# Altium project ayplayer2.22.PrjPCB
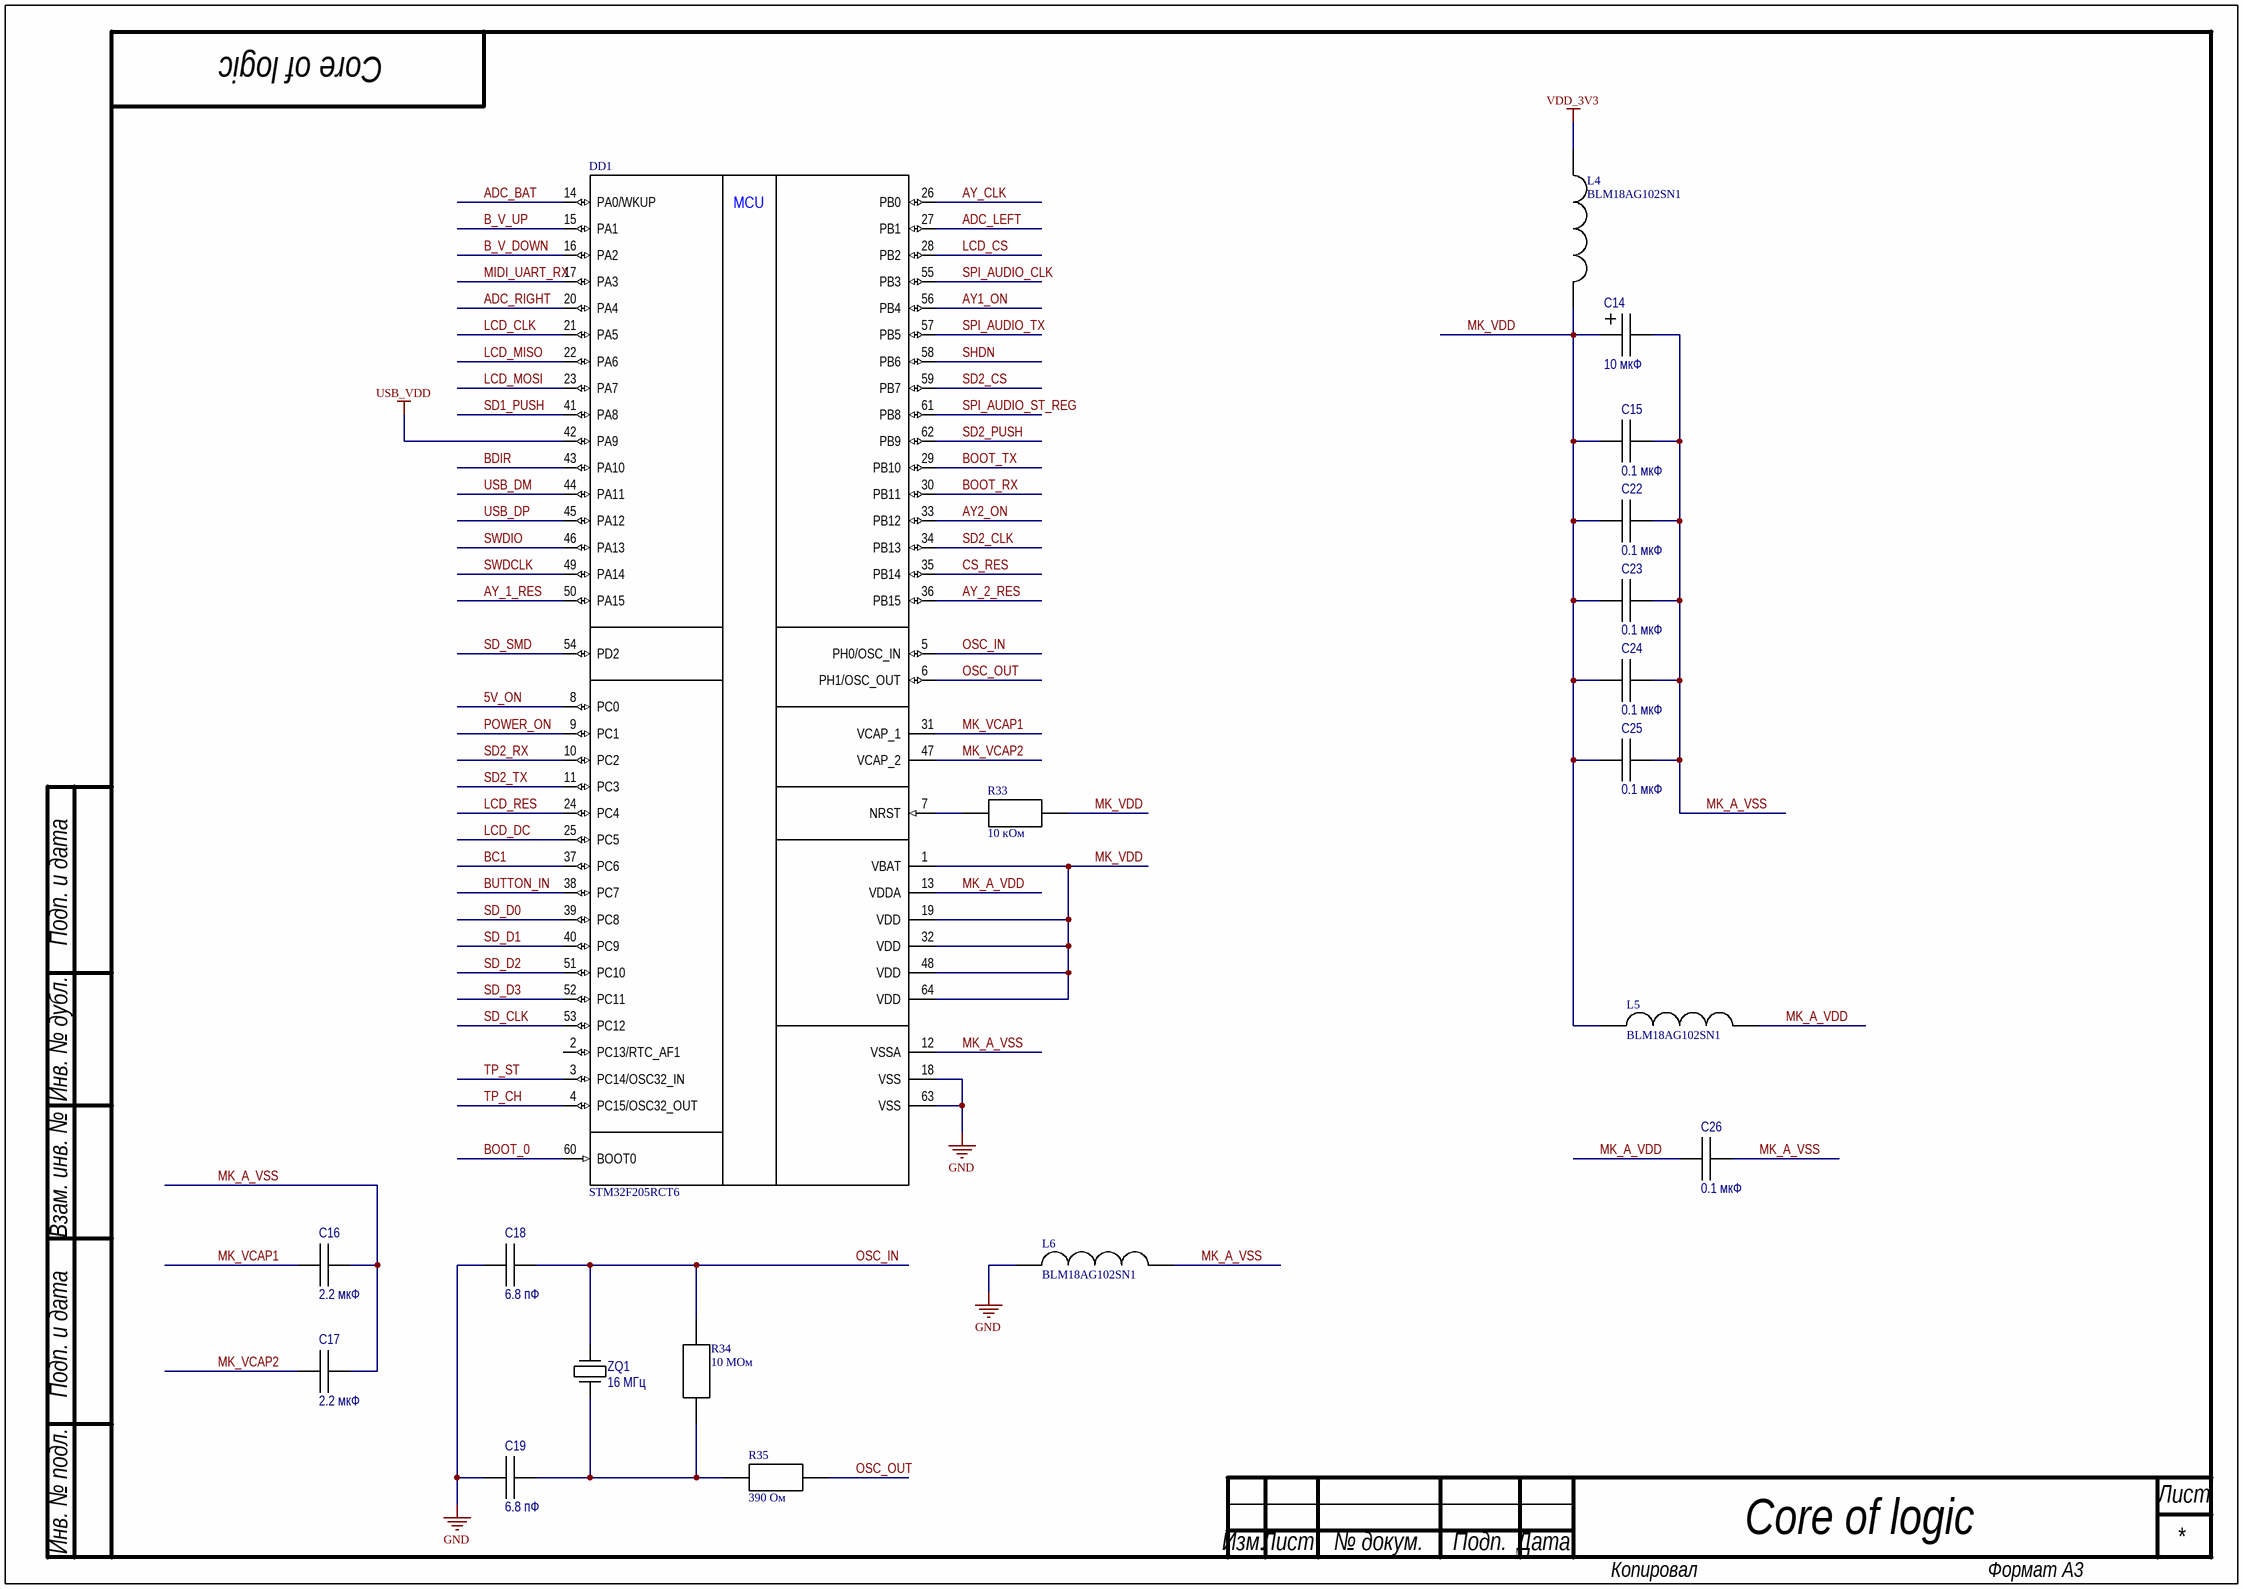
[diagram p0: mk.SchDoc]
5 sheets, 161 parts. Net scope: global (net labels, ports and power ports of the same name join across sheets).
Board file: main.PcbDoc
Sheets:
  mk.SchDoc
  power_sheet.SchDoc
  conect_sheet.SchDoc
  audio_sheet.SchDoc
  audio_out.SchDoc

## Sheet mk.SchDoc
size 420 x 297 mm; DocumentNumber: Core of logic

### Parts
C14  10 мкФ  [C TAN_C]
C15  0.1 мкФ  [C 1206]
C16  2.2 мкФ  [C 1206]
C17  2.2 мкФ  [C 1206]
C18  6.8 пФ  [C 1206]
C19  6.8 пФ  [C 1206]
C22  0.1 мкФ  [C 1206]
C23  0.1 мкФ  [C 1206]
C24  0.1 мкФ  [C 1206]
C25  0.1 мкФ  [C 1206]
C26  0.1 мкФ  [C 1206]
DD1  STM32F205RCT6  [LQFP64]
L4  BLM18AG102SN1  [FB 0603]
L5  BLM18AG102SN1  [FB 0603]
L6  BLM18AG102SN1  [FB 0603]
R33  10 кОм  [RES 0805]
R34  10 МОм  [RES 0805]
R35  390 Ом  [RES 0805]
ZQ1  value 16 МГц  [NX3225SA]  (hidden comment: NX3225SA-16.000M-STD-CRS-2)

### Nets
GND: C18.1 C19.1 DD1.18(VSS) DD1.63(VSS) L6.1
USB_VDD: DD1.42(PA9)
VDD_3V3: L4.1
5V_ON: DD1.8(PC0)
ADC_BAT: DD1.14(PA0/WKUP)
ADC_LEFT: DD1.27(PB1)
ADC_RIGHT: DD1.20(PA4)
AY1_ON: DD1.56(PB4)
AY2_ON: DD1.33(PB12)
AY_1_RES: DD1.50(PA15)
AY_2_RES: DD1.36(PB15)
AY_CLK: DD1.26(PB0)
B_V_DOWN: DD1.16(PA2)
B_V_UP: DD1.15(PA1)
BC1: DD1.37(PC6)
BDIR: DD1.43(PA10)
BOOT_0: DD1.60(BOOT0)
BOOT_RX: DD1.30(PB11)
BOOT_TX: DD1.29(PB10)
BUTTON_IN: DD1.38(PC7)
CS_RES: DD1.35(PB14)
LCD_CLK: DD1.21(PA5)
LCD_CS: DD1.28(PB2)
LCD_DC: DD1.25(PC5)
LCD_MISO: DD1.22(PA6)
LCD_MOSI: DD1.23(PA7)
LCD_RES: DD1.24(PC4)
MIDI_UART_RX: DD1.17(PA3)
MK_A_VDD: C26.1 DD1.13(VDDA) L5.2
MK_A_VSS: C14.2 C15.2 C16.2 C17.2 C22.2 C23.2 C24.2 C25.2 C26.2 DD1.12(VSSA) L6.2
MK_VCAP1: C16.1 DD1.31(VCAP_1)
MK_VCAP2: C17.1 DD1.47(VCAP_2)
MK_VDD: C14.1 C15.1 C22.1 C23.1 C24.1 C25.1 DD1.1(VBAT) DD1.19(VDD) DD1.32(VDD) DD1.48(VDD) DD1.64(VDD) L4.2 L5.1 R33.2
OSC_IN: C18.2 DD1.5(PH0/OSC_IN) R34.2 ZQ1.3(XO)
OSC_OUT: DD1.6(PH1/OSC_OUT) R35.2
POWER_ON: DD1.9(PC1)
SD1_PUSH: DD1.41(PA8)
SD2_CLK: DD1.34(PB13)
SD2_CS: DD1.59(PB7)
SD2_PUSH: DD1.62(PB9)
SD2_RX: DD1.10(PC2)
SD2_TX: DD1.11(PC3)
SD_CLK: DD1.53(PC12)
SD_D0: DD1.39(PC8)
SD_D1: DD1.40(PC9)
SD_D2: DD1.51(PC10)
SD_D3: DD1.52(PC11)
SD_SMD: DD1.54(PD2)
SHDN: DD1.58(PB6)
SPI_AUDIO_CLK: DD1.55(PB3)
SPI_AUDIO_ST_REG: DD1.61(PB8)
SPI_AUDIO_TX: DD1.57(PB5)
SWDCLK: DD1.49(PA14)
SWDIO: DD1.46(PA13)
TP_CH: DD1.4(PC15/OSC32_OUT)
TP_ST: DD1.3(PC14/OSC32_IN)
USB_DM: DD1.44(PA11)
USB_DP: DD1.45(PA12)
NetC19_2: C19.2 R34.1 R35.1 ZQ1.1(XI)
NetDD1_7: DD1.7(NRST) R33.1

Not connected (* = marked no-connect by the designer): DD1 2(PC13/RTC_AF1); ZQ1 2(NC) 4(NC)

### Notes on the sheet
- Подп. и дата
- Инв. № дубл.
- Взам. инв. №
- Инв. № подл.
- Лист
- Изм.
- № докум.
- Подп.
- Дата
- Копировал
- Формат А3
- (in symbol STM32F205RCT6) MCU

### Library data of the parts
C14 = CAP TAN_C: SMD Tantalium Capacitor C; Manufacturer: /Укажите компанию-производителя/; Tolerance: /Укажите допуск в процентах/; Type: Конденсатор танталовый; ESR: /Укажите значение ЭПС/; Size: C; Temperature range: /Формат: -? ... ? °C/; Value: 10 мкФ
C15-C19 C22-C26 = CAP 1206: SMD Capacitor 1206; Manufacturer: /Укажите компанию-производителя/; Tolerance: /Укажите допуск в процентах/; Temperature coefficient: /Формат: ±? ppm/°C/; Type: Конденсатор керамический; TC: /Укажите тип диэлектрика/; Size: 1206; Temperature range: /Формат: -? ... ? °C/
  C15 C22-C26: Value: 0.1 мкФ
  C16 C17: Value: 2.2 мкФ
  C18 C19: Value: 6.8 пФ
R33-R35 = RES 0805
ZQ1 = NX3225SA-16.000M-STD-CRS-2: QUARTZ CRYSTAL; Manufacturer: NDK; Load capacitance: 8 пФ; Frequency stability: ±15 ppm; Type: Кварцевый резонатор; Temperature range: -40 ... 125 °C

## Sheet power_sheet.SchDoc
size 420 x 297 mm; DocumentNumber: Power supply
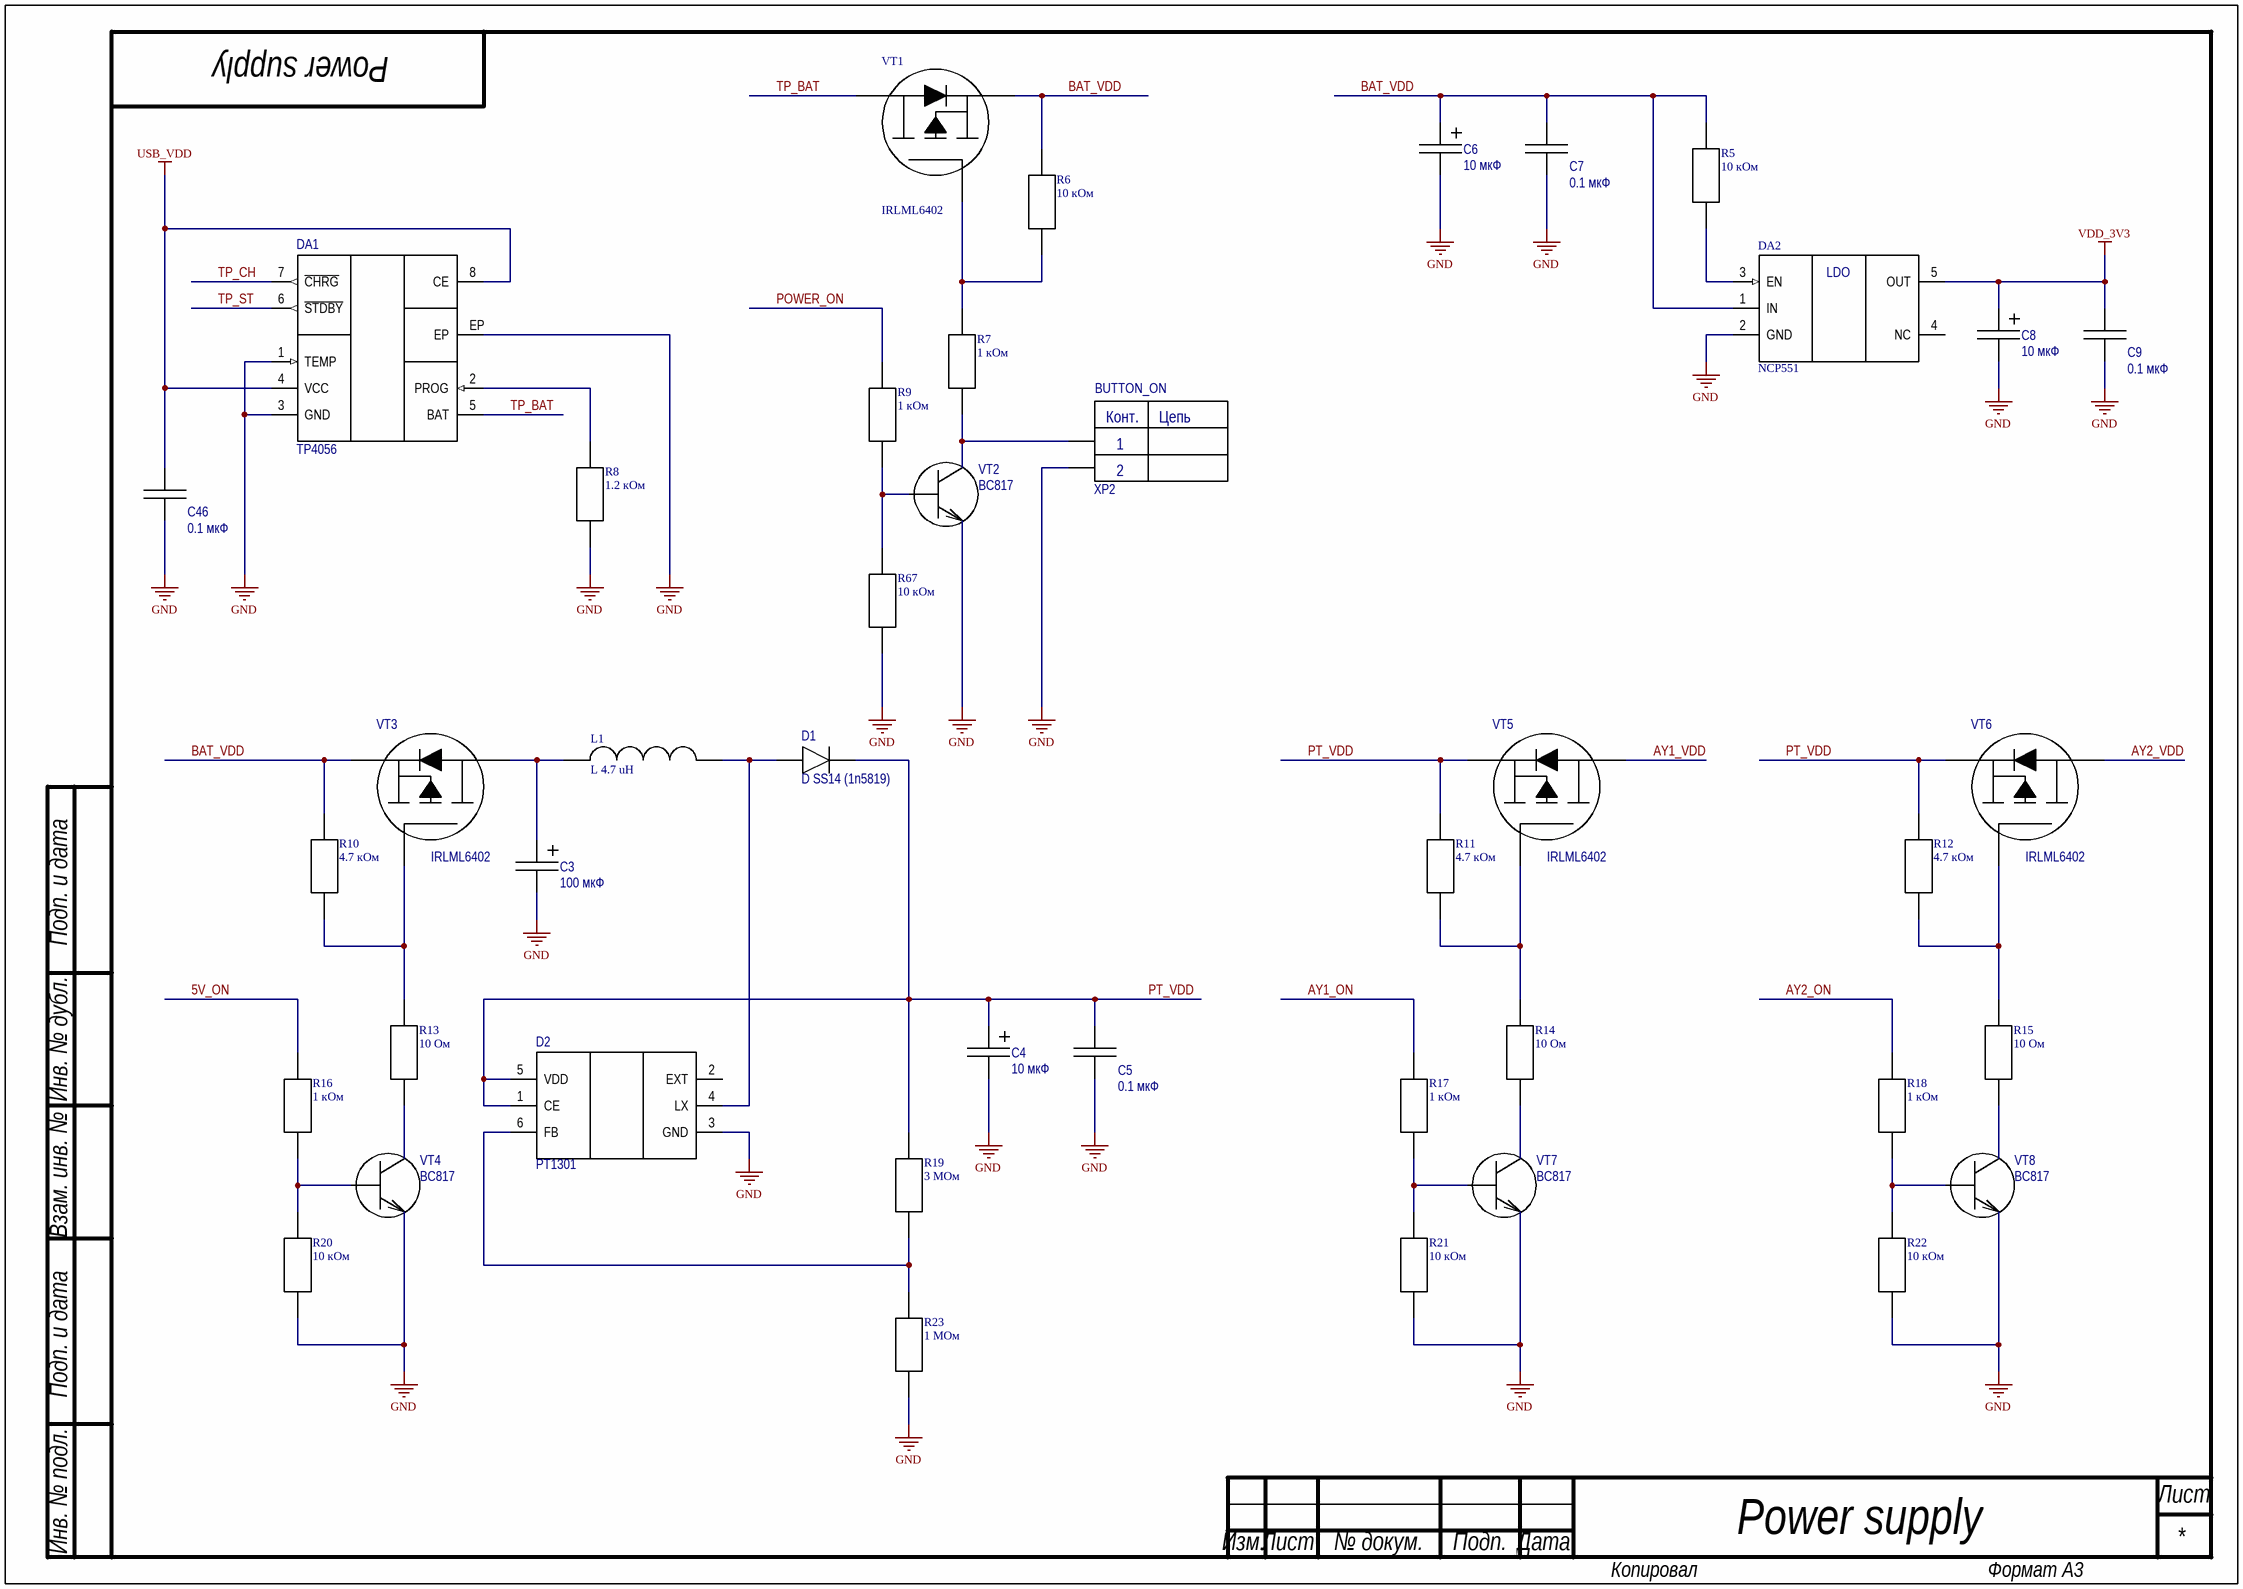
[diagram p1: power_sheet.SchDoc]

### Parts
C3  100 мкФ  [C TAN_D]
C4  10 мкФ  [C TAN_C]
C5  0.1 мкФ  [C 1206]
C6  10 мкФ  [C TAN_C]
C7  0.1 мкФ  [C 1206]
C8  10 мкФ  [C TAN_C]
C9  0.1 мкФ  [C 1206]
C46  0.1 мкФ  [C 1206]
D1  D SS14 (1n5819)  [SMA/DO-214AC]
D2  PT1301  [SOT-23-6]
DA1  TP4056  [HSOP-8]
DA2  NCP551  [TSOP-5]
L1  L 4.7 uH  [CD43]
R5  10 кОм  [RES 0805]
R6  10 кОм  [RES 0805]
R7  1 кОм  [RES 0805]
R8  1.2 кОм  [RES 0805]
R9  1 кОм  [RES 0805]
R10  4.7 кОм  [RES 0805]
R11  4.7 кОм  [RES 0805]
R12  4.7 кОм  [RES 0805]
R13  10 Ом  [RES 0805]
R14  10 Ом  [RES 0805]
R15  10 Ом  [RES 0805]
R16  1 кОм  [RES 0805]
R17  1 кОм  [RES 0805]
R18  1 кОм  [RES 0805]
R19  3 МОм  [RES 0805]
R20  10 кОм  [RES 0805]
R21  10 кОм  [RES 0805]
R22  10 кОм  [RES 0805]
R23  1 МОм  [RES 0805]
R67  10 кОм  [RES 0805]
VT1  IRLML6402  [SOT-23]
VT2  BC817  [SOT-23]
VT3  IRLML6402  [SOT-23]
VT4  BC817  [SOT-23]
VT5  IRLML6402  [SOT-23]
VT6  IRLML6402  [SOT-23]
VT7  BC817  [SOT-23]
VT8  BC817  [SOT-23]
XP2  PLS-2  [PLS-2]  (value not drawn)

### Nets
GND: C3.2 C4.2 C5.2 C6.2 C7.2 C8.2 C9.2 C46.2 D2.3(GND) DA1.1(TEMP) DA1.3(GND) DA1.EP DA2.2(GND) R8.1 R20.1 R21.1 R22.1 R23.1 R67.1 VT2.2(E) VT4.2(E) VT7.2(E) VT8.2(E) XP2.2
USB_VDD: C46.1 DA1.4(VCC) DA1.8(CE)
VDD_3V3: C8.1 C9.1 DA2.5(OUT)
5V_ON: R16.2
AY1_ON: R17.2
AY1_VDD: VT5.3(D)
AY2_ON: R18.2
AY2_VDD: VT6.3(D)
BAT_VDD: C6.1 C7.1 DA2.1(IN) R5.2 R6.2 R10.2 VT1.2(S) VT3.2(S)
POWER_ON: R9.2
PT_VDD: C4.1 C5.1 D1.C D2.1(CE) D2.5(VDD) R11.2 R12.2 R19.2 VT5.2(S) VT6.2(S)
TP_BAT: DA1.5(BAT) VT1.3(D)
TP_CH: DA1.7(~{CHRG})
TP_ST: DA1.6(~{STDBY})
NetC3_1: C3.1 L1.1 VT3.3(D)
NetD1_A: D1.A D2.4(LX) L1.2
NetD2_6: D2.6(FB) R19.1 R23.2
NetDA1_2: DA1.2(PROG) R8.2
NetDA2_3: DA2.3(EN) R5.1
NetR6_1: R6.1 R7.2 VT1.1(G)
NetR7_1: R7.1 VT2.3(C) XP2.1
NetR9_1: R9.1 R67.2 VT2.1(B)
NetR10_1: R10.1 R13.2 VT3.1(G)
NetR11_1: R11.1 R14.2 VT5.1(G)
NetR12_1: R12.1 R15.2 VT6.1(G)
NetR13_1: R13.1 VT4.3(C)
NetR14_1: R14.1 VT7.3(C)
NetR15_1: R15.1 VT8.3(C)
NetR16_1: R16.1 R20.2 VT4.1(B)
NetR17_1: R17.1 R21.2 VT7.1(B)
NetR18_1: R18.1 R22.2 VT8.1(B)

Not connected (* = marked no-connect by the designer): D2 2(EXT); DA2 4(NC)

### Notes on the sheet
- (near XP2) BUTTON_ON
- Подп. и дата
- Инв. № дубл.
- Взам. инв. №
- Инв. № подл.
- Лист
- Изм.
- № докум.
- Подп.
- Дата
- Копировал
- Формат А3
- (in symbol NCP551) LDO
- (in symbol PLS-2) Конт.; Цепь

### Library data of the parts
C3 = CAP TAN_D: SMD Tantalium Capacitor D; Manufacturer: /Укажите компанию-производителя/; Tolerance: /Укажите допуск в процентах/; Type: Конденсатор танталовый; ESR: /Укажите значение ЭПС/; Rated voltage: 10 В; Size: D; Temperature range: /Формат: -? ... ? °C/; Value: 100 мкФ
C4 C6 C8 = CAP TAN_C: as C14 on sheet mk; Size: C; Temperature range: /Формат: -? ... ? °C/; Value: 10 мкФ
C5 C7 C9 C46 = CAP 1206: as C15 on sheet mk; Size: 1206; Temperature range: /Формат: -? ... ? °C/; Value: 0.1 мкФ
D2 = PT1301: DC-DC step-up (повышающий) PT1301 в корпусе SOT23-6.
L1 = L 4.7 uH: Катушка индуктивности 4.7 мкГн корпус CD43 (индуктивность 4.7 uH).
R5-R23 R67 = RES 0805
VT2 VT4 VT7 VT8 = BC817: NPN general-purpose transistor; Manufacturer: NXP; Structure: n-p-n; Type: Транзистор биполярный; hFE: 160 ... 600; Max collector-emitter voltage: 45 В; Max collector-base voltage: 50 В; Max emitter-base voltage: 5 В; Max collector current: 0,5 А; Max collector peak current: 1 А; Power dissitipation: 0,25 Вт; fT: 100 МГц; Collector-emitter saturation voltage: 0,7 В; Base-emitter on voltage: 1,2 В; Specitication: ЭКБ ИП; Collector-base сapacitance: 3 пФ; Complement: BC807; Temperature range: -65 ... 150 °C
XP2 = PLS-2: PLS connector; Manufacturer: NONAME; Connector type: Вилка на плату; Number of contacts: 2; Type: Разъем штыревой

## Sheet conect_sheet.SchDoc
size 420 x 297 mm; DocumentNumber: Connectors
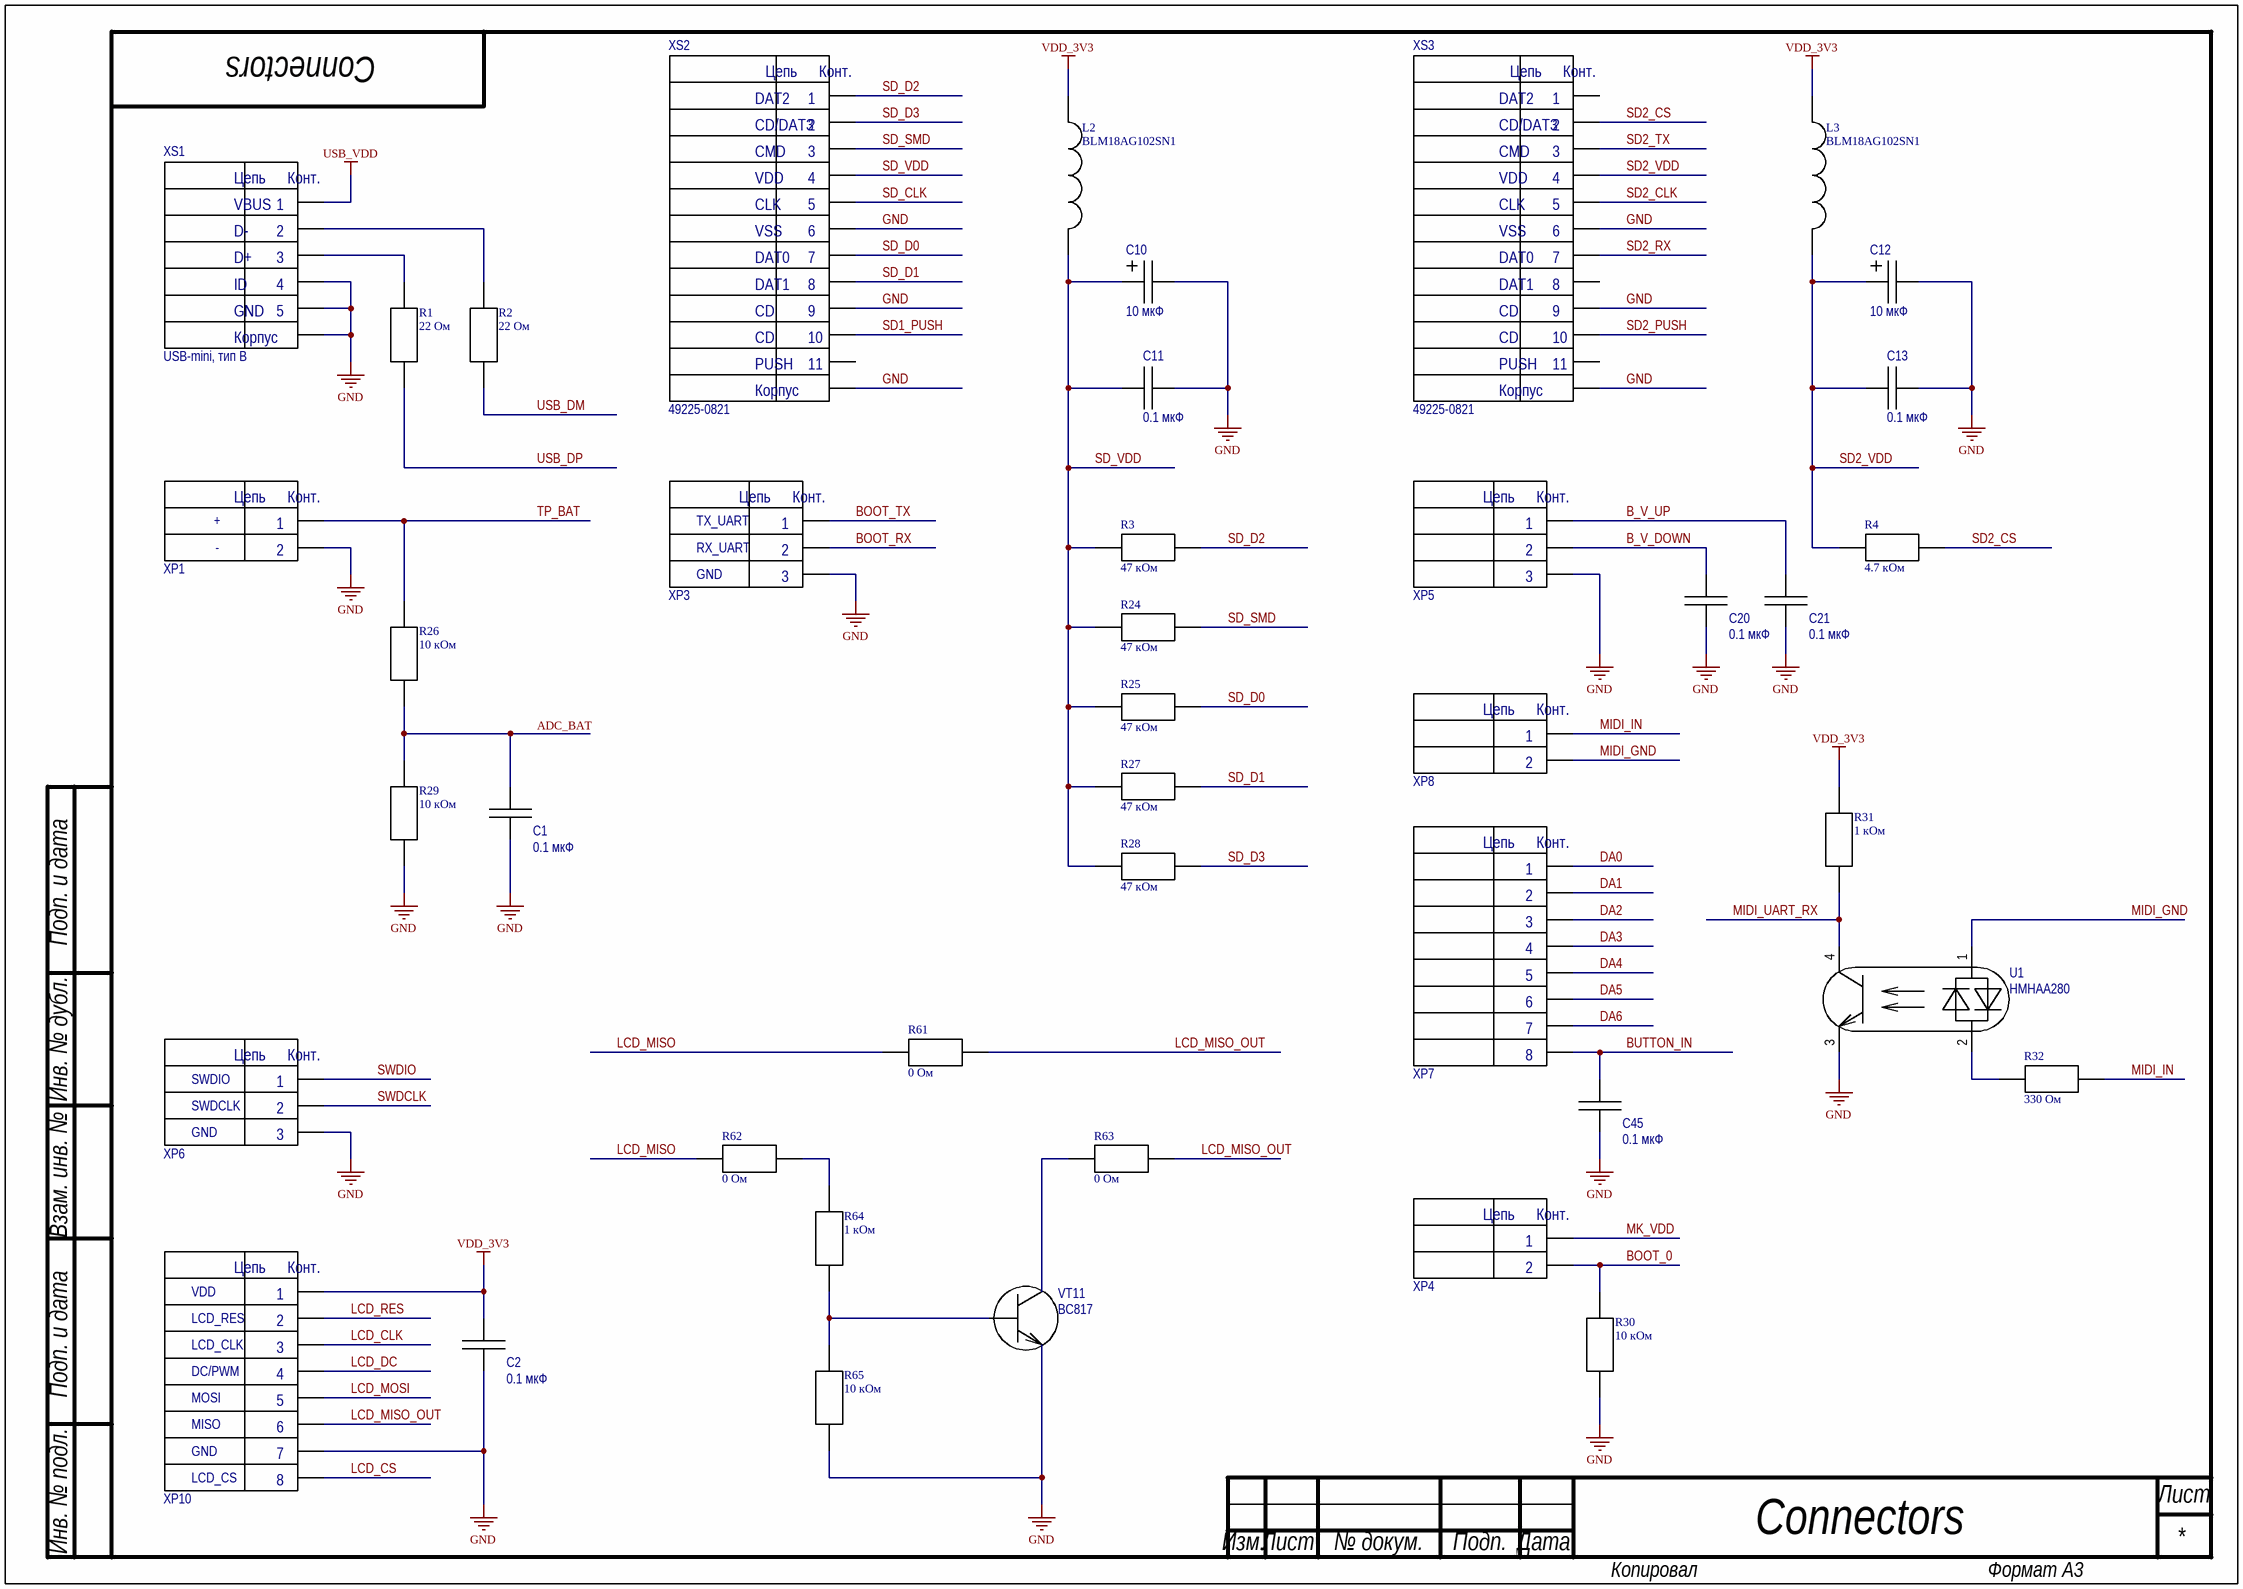
[diagram p2: conect_sheet.SchDoc]

### Parts
C1  0.1 мкФ  [C 1206]
C2  0.1 мкФ  [C 1206]
C10  10 мкФ  [C TAN_C]
C11  0.1 мкФ  [C 1206]
C12  10 мкФ  [C TAN_C]
C13  0.1 мкФ  [C 1206]
C20  0.1 мкФ  [C 1206]
C21  0.1 мкФ  [C 1206]
C45  0.1 мкФ  [C 1206]
L2  BLM18AG102SN1  [FB 0603]
L3  BLM18AG102SN1  [FB 0603]
R1  22 Ом  [RES 0805]
R2  22 Ом  [RES 0805]
R3  47 кОм  [RES 0805]
R4  4.7 кОм  [RES 0805]
R24  47 кОм  [RES 0805]
R25  47 кОм  [RES 0805]
R26  10 кОм  [RES 0805]
R27  47 кОм  [RES 0805]
R28  47 кОм  [RES 0805]
R29  10 кОм  [RES 0805]
R30  10 кОм  [RES 0805]
R31  1 кОм  [RES 0805]
R32  330 Ом  [RES 0805]
R61  0 Ом  [RES 0805]
R62  0 Ом  [RES 0805]
R63  0 Ом  [RES 0805]
R64  1 кОм  [RES 0805]
R65  10 кОм  [RES 0805]
U1  HMHAA280  [MFP-4L]
VT11  BC817  [SOT-23]
XP1  PLS-2  [PLS-2]  (value not drawn)
XP3  PLS-3  [PLS-3]  (value not drawn)
XP4  PLS-2  [PLS-2]  (value not drawn)
XP5  PLS-3  [PLS-3]  (value not drawn)
XP6  PLS-3  [PLS-3]  (value not drawn)
XP7  PLD-8  [PLD-8]  (value not drawn)
XP8  PLS-2  [PLS-2]  (value not drawn)
XP10  PLD-8  [PLD-8]  (value not drawn)
XS1  USB-mini, тип B  [USB_mini_B]
XS2  49225-0821  [MOLEX 49225-0821]
XS3  49225-0821  [MOLEX 49225-0821]

### Nets
GND: C1.2 C2.2 C10.2 C11.2 C12.2 C13.2 C20.2 C21.2 C45.2 R29.1 R30.1 R65.1 U1.3(E) VT11.2(E) XP1.2 XP3.3 XP5.3 XP6.3 XP10.7 XS1.0 XS1.4(CASE) XS1.5(GND) XS2.0 XS2.6 XS2.9 XS3.0 XS3.6 XS3.9
USB_VDD: XS1.1(VBUS)
VDD_3V3: C2.1 L2.1 L3.1 R31.2 XP10.1
ADC_BAT: C1.1 R26.1 R29.2
B_V_DOWN: C20.1 XP5.2
B_V_UP: C21.1 XP5.1
BOOT_0: R30.2 XP4.2
BOOT_RX: XP3.2
BOOT_TX: XP3.1
BUTTON_IN: C45.1 XP7.8
DA0: XP7.1
DA1: XP7.2
DA2: XP7.3
DA3: XP7.4
DA4: XP7.5
DA5: XP7.6
DA6: XP7.7
LCD_CLK: XP10.3
LCD_CS: XP10.8
LCD_DC: XP10.4
LCD_MISO: R61.1 R62.2
LCD_MISO_OUT: R61.2 R63.1 XP10.6
LCD_MOSI: XP10.5
LCD_RES: XP10.2
MIDI_GND: U1.1(AC) XP8.2
MIDI_IN: R32.2 XP8.1
MIDI_UART_RX: R31.1 U1.4(C)
MK_VDD: XP4.1
SD1_PUSH: XS2.10
SD2_CLK: XS3.5
SD2_CS: R4.2 XS3.2
SD2_PUSH: XS3.10
SD2_RX: XS3.7
SD2_TX: XS3.3
SD2_VDD: C12.1 C13.1 L3.2 R4.1 XS3.4
SD_CLK: XS2.5
SD_D0: R25.2 XS2.7
SD_D1: R27.2 XS2.8
SD_D2: R3.2 XS2.1
SD_D3: R28.2 XS2.2
SD_SMD: R24.2 XS2.3
SD_VDD: C10.1 C11.1 L2.2 R3.1 R24.1 R25.1 R27.1 R28.1 XS2.4
SWDCLK: XP6.2
SWDIO: XP6.1
TP_BAT: R26.2 XP1.1
USB_DM: R2.1
USB_DP: R1.1
NetR1_2: R1.2 XS1.3(D+)
NetR2_2: R2.2 XS1.2(D-)
NetR32_1: R32.1 U1.2(CA)
NetR62_1: R62.1 R64.2
NetR63_2: R63.2 VT11.3(C)
NetR64_1: R64.1 R65.2 VT11.1(B)

Not connected (* = marked no-connect by the designer): XS2 11; XS3 1 8 11

### Notes on the sheet
- +
- TX_UART
- -
- RX_UART
- GND
- SWDIO
- SWDCLK
- VDD
- LCD_RES
- LCD_CLK
- MOSI
- DC/PWM
- LCD_CS
- MISO
- Подп. и дата
- Инв. № дубл.
- Взам. инв. №
- Инв. № подл.
- Лист
- Изм.
- № докум.
- Подп.
- Дата
- Копировал
- Формат А3
- (in symbol 49225-0821) Цепь; Конт.; DAT2; CD/DAT3; CMD; VDD; CLK; VSS; DAT0; DAT1; CD; PUSH; Корпус
- (in symbol PLD-8) Цепь; Конт.
- (in symbol PLS-2) Цепь; Конт.
- (in symbol PLS-3) Цепь; Конт.
- (in symbol USB-mini_B) Цепь; Конт.; ID; Корпус

### Library data of the parts
C1 C2 C11 C13 C20 C21 C45 = CAP 1206: as C15 on sheet mk; Size: 1206; Temperature range: /Формат: -? ... ? °C/; Value: 0.1 мкФ
C10 C12 = CAP TAN_C: as C14 on sheet mk; Size: C; Temperature range: /Формат: -? ... ? °C/; Value: 10 мкФ
R1-R4 R24-R32 R61-R65 = RES 0805
U1 = HMHAA280: AC Input Half Pitch Mini-Flat Package 4-pin Optocoupler; Manufacturer: Fairchild Semiconductor; Emitter forward voltage: 1,4 В; Emitter power dissitipation: 60 мВт; Isolation voltage: 3750 В; Detector collector current: 50 мА; Emitter reverse voltage: 6 В; Detector collector-emitter voltage: 80 В; Detector power dissitipation: 150 мВт; Temperature range: -55 ... 100 °C; Type: Оптрон; Emitter forward current: 50 мА
VT11 = BC817: as VT2 on sheet power_sheet; Temperature range: -65 ... 150 °C
XP1 XP4 XP8 = PLS-2: as XP2 on sheet power_sheet; Type: Разъем штыревой
XP3 XP5 XP6 = PLS-3: PLS connector; Manufacturer: NONAME; Connector type: Вилка на плату; Number of contacts: 3; Type: Разъем штыревой
XP7 XP10 = PLD-8: PLD connector; Manufacturer: NONAME; Connector type: Вилка на плату; Number of contacts: 8; Type: Разъем штыревой
XS1 = USB-mini_B: USB-mini-B connector; Manufacturer: NONAME; Connector type: USB-mini, тип B на плату; Number of contacts: 5; Type: Разъем
XS2 XS3 = 49225-0821: MOLEX MicroSD connector; Connector type: Разъем MicroSD на плату; Number of contacts: 11; Manufacturer: Molex; Type: Разъем

## Sheet audio_sheet.SchDoc
size 420 x 297 mm; DocumentNumber: Audio core
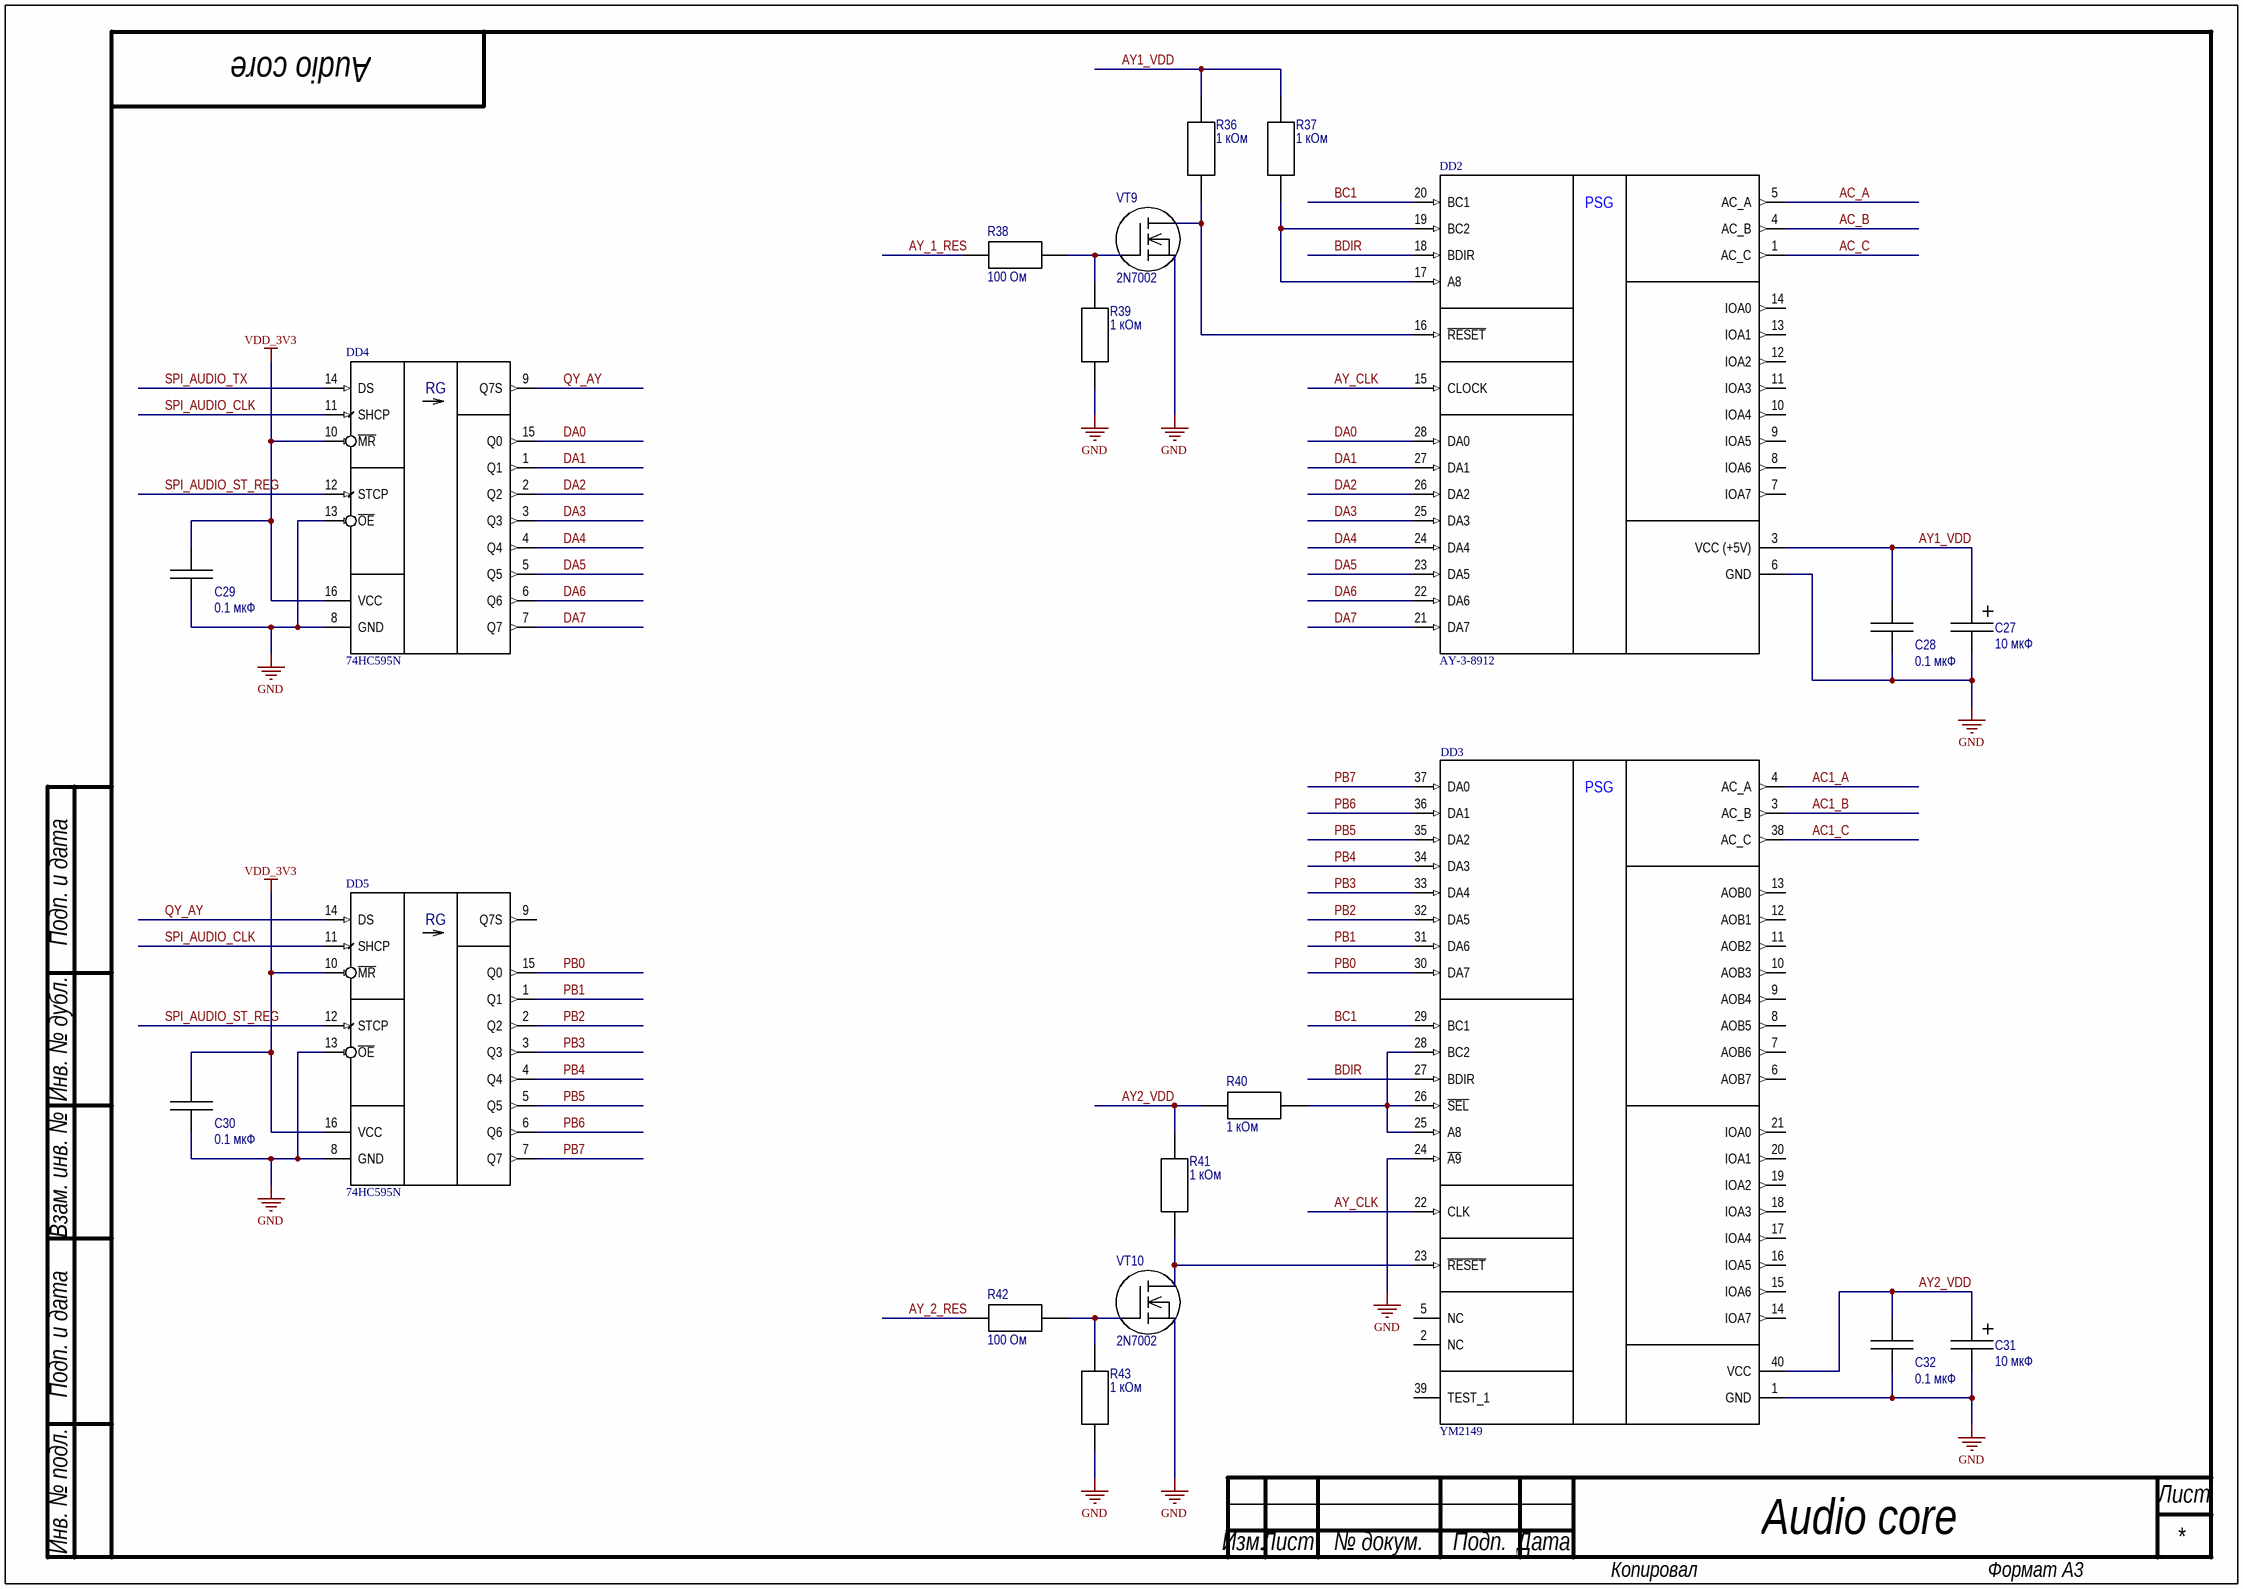
[diagram p3: audio_sheet.SchDoc]

### Parts
C27  10 мкФ  [C TAN_C]
C28  0.1 мкФ  [C 1206]
C29  0.1 мкФ  [C 1206]
C30  0.1 мкФ  [C 1206]
C31  10 мкФ  [C TAN_C]
C32  0.1 мкФ  [C 1206]
DD2  AY-3-8912  [DIP-28]
DD3  YM2149  [DIP-40]
DD4  74HC595N  [SO16]
DD5  74HC595N  [SO16]
R36  1 кОм  [RES 0402]
R37  1 кОм  [RES 0402]
R38  100 Ом  [RES 0402]
R39  1 кОм  [RES 0402]
R40  1 кОм  [RES 0402]
R41  1 кОм  [RES 0402]
R42  100 Ом  [RES 0402]
R43  1 кОм  [RES 0402]
VT9  2N7002  [SOT-23]
VT10  2N7002  [SOT-23]

### Nets
GND: C27.2 C28.2 C29.2 C30.2 C31.2 C32.2 DD2.6(GND) DD3.1(GND) DD3.24(~{A9}) DD4.8(GND) DD4.13(~{OE}) DD5.8(GND) DD5.13(~{OE}) R39.2 R43.2 VT9.2(S) VT10.2(S)
VDD_3V3: C29.1 C30.1 DD4.10(~{MR}) DD4.16(VCC) DD5.10(~{MR}) DD5.16(VCC)
AC1_A: DD3.4(AC_A)
AC1_B: DD3.3(AC_B)
AC1_C: DD3.38(AC_C)
AC_A: DD2.5(AC_A)
AC_B: DD2.4(AC_B)
AC_C: DD2.1(AC_C)
AY1_VDD: C27.1 C28.1 DD2.3(VCC_(+5V)) R36.1 R37.1
AY2_VDD: C31.1 C32.1 DD3.40(VCC) R40.1 R41.1
AY_1_RES: R38.1
AY_2_RES: R42.1
AY_CLK: DD2.15(CLOCK) DD3.22(CLK)
BC1: DD2.20(BC1) DD3.29(BC1)
BDIR: DD2.18(BDIR) DD3.27(BDIR)
DA0: DD2.28(DA0) DD4.15(Q0)
DA1: DD2.27(DA1) DD4.1(Q1)
DA2: DD2.26(DA2) DD4.2(Q2)
DA3: DD2.25(DA3) DD4.3(Q3)
DA4: DD2.24(DA4) DD4.4(Q4)
DA5: DD2.23(DA5) DD4.5(Q5)
DA6: DD2.22(DA6) DD4.6(Q6)
DA7: DD2.21(DA7) DD4.7(Q7)
PB0: DD3.30(DA7) DD5.15(Q0)
PB1: DD3.31(DA6) DD5.1(Q1)
PB2: DD3.32(DA5) DD5.2(Q2)
PB3: DD3.33(DA4) DD5.3(Q3)
PB4: DD3.34(DA3) DD5.4(Q4)
PB5: DD3.35(DA2) DD5.5(Q5)
PB6: DD3.36(DA1) DD5.6(Q6)
PB7: DD3.37(DA0) DD5.7(Q7)
QY_AY: DD4.9(Q7S) DD5.14(DS)
SPI_AUDIO_CLK: DD4.11(SHCP) DD5.11(SHCP)
SPI_AUDIO_ST_REG: DD4.12(STCP) DD5.12(STCP)
SPI_AUDIO_TX: DD4.14(DS)
NetDD2_16: DD2.16(~{RESET}) R36.2 VT9.3(D)
NetDD2_17: DD2.17(A8) DD2.19(BC2) R37.2
NetDD3_23: DD3.23(~{RESET}) R41.2 VT10.3(D)
NetDD3_25: DD3.25(A8) DD3.26(~{SEL}) DD3.28(BC2) R40.2
NetR38_2: R38.2 R39.1 VT9.1(G)
NetR42_2: R42.2 R43.1 VT10.1(G)

Not connected (* = marked no-connect by the designer): DD2 7(IOA7) 8(IOA6) 9(IOA5) 10(IOA4) 11(IOA3) 12(IOA2) 13(IOA1) 14(IOA0); DD3 2(NC) 5(NC) 6(AOB7) 7(AOB6) 8(AOB5) 9(AOB4) 10(AOB3) 11(AOB2) 12(AOB1) 13(AOB0) 14(IOA7) 15(IOA6) 16(IOA5) 17(IOA4) 18(IOA3) 19(IOA2) 20(IOA1) 21(IOA0) 39(TEST_1); DD5 9(Q7S)

### Notes on the sheet
- Подп. и дата
- Инв. № дубл.
- Взам. инв. №
- Инв. № подл.
- Лист
- Изм.
- № докум.
- Подп.
- Дата
- Копировал
- Формат А3
- (in symbol 74HC595N) RG
- (in symbol AY-3-8912) PSG
- (in symbol YM2149) PSG

### Library data of the parts
C27 C31 = CAP TAN_C: as C14 on sheet mk; Size: C; Temperature range: /Формат: -? ... ? °C/; Value: 10 мкФ
C28-C30 C32 = CAP 1206: as C15 on sheet mk; Size: 1206; Temperature range: /Формат: -? ... ? °C/; Value: 0.1 мкФ
R36-R43 = RES 0402
VT9 VT10 = 2N7002: 60 V, 300 mA N-channel Trench MOSFET; Manufacturer: NXP; Structure: Индуцированный канал n-типа; Type: Транзистор полевой с изолированным затвором; Max gate-to-source voltage: 30 В; Drain-to-source breakdown voltage: 60 В; Gate threshold voltage: 2 В; Max continuous drain current: 300 мА; Max pulsed drain current: 1,2 А; Power dissitipation: 0,83 Вт; Input capacitance: 31 пФ; Output capacitance: 6,8 пФ; Turn-on time: 2,5 нс; Reverse transfer capacitance: 3,5 пФ; Turn-off time: 11 нс; Rds: 2,8 Ом; Temperature range: -65 ... 150 °C

## Sheet audio_out.SchDoc
size 420 x 297 mm; DocumentNumber: Audio output
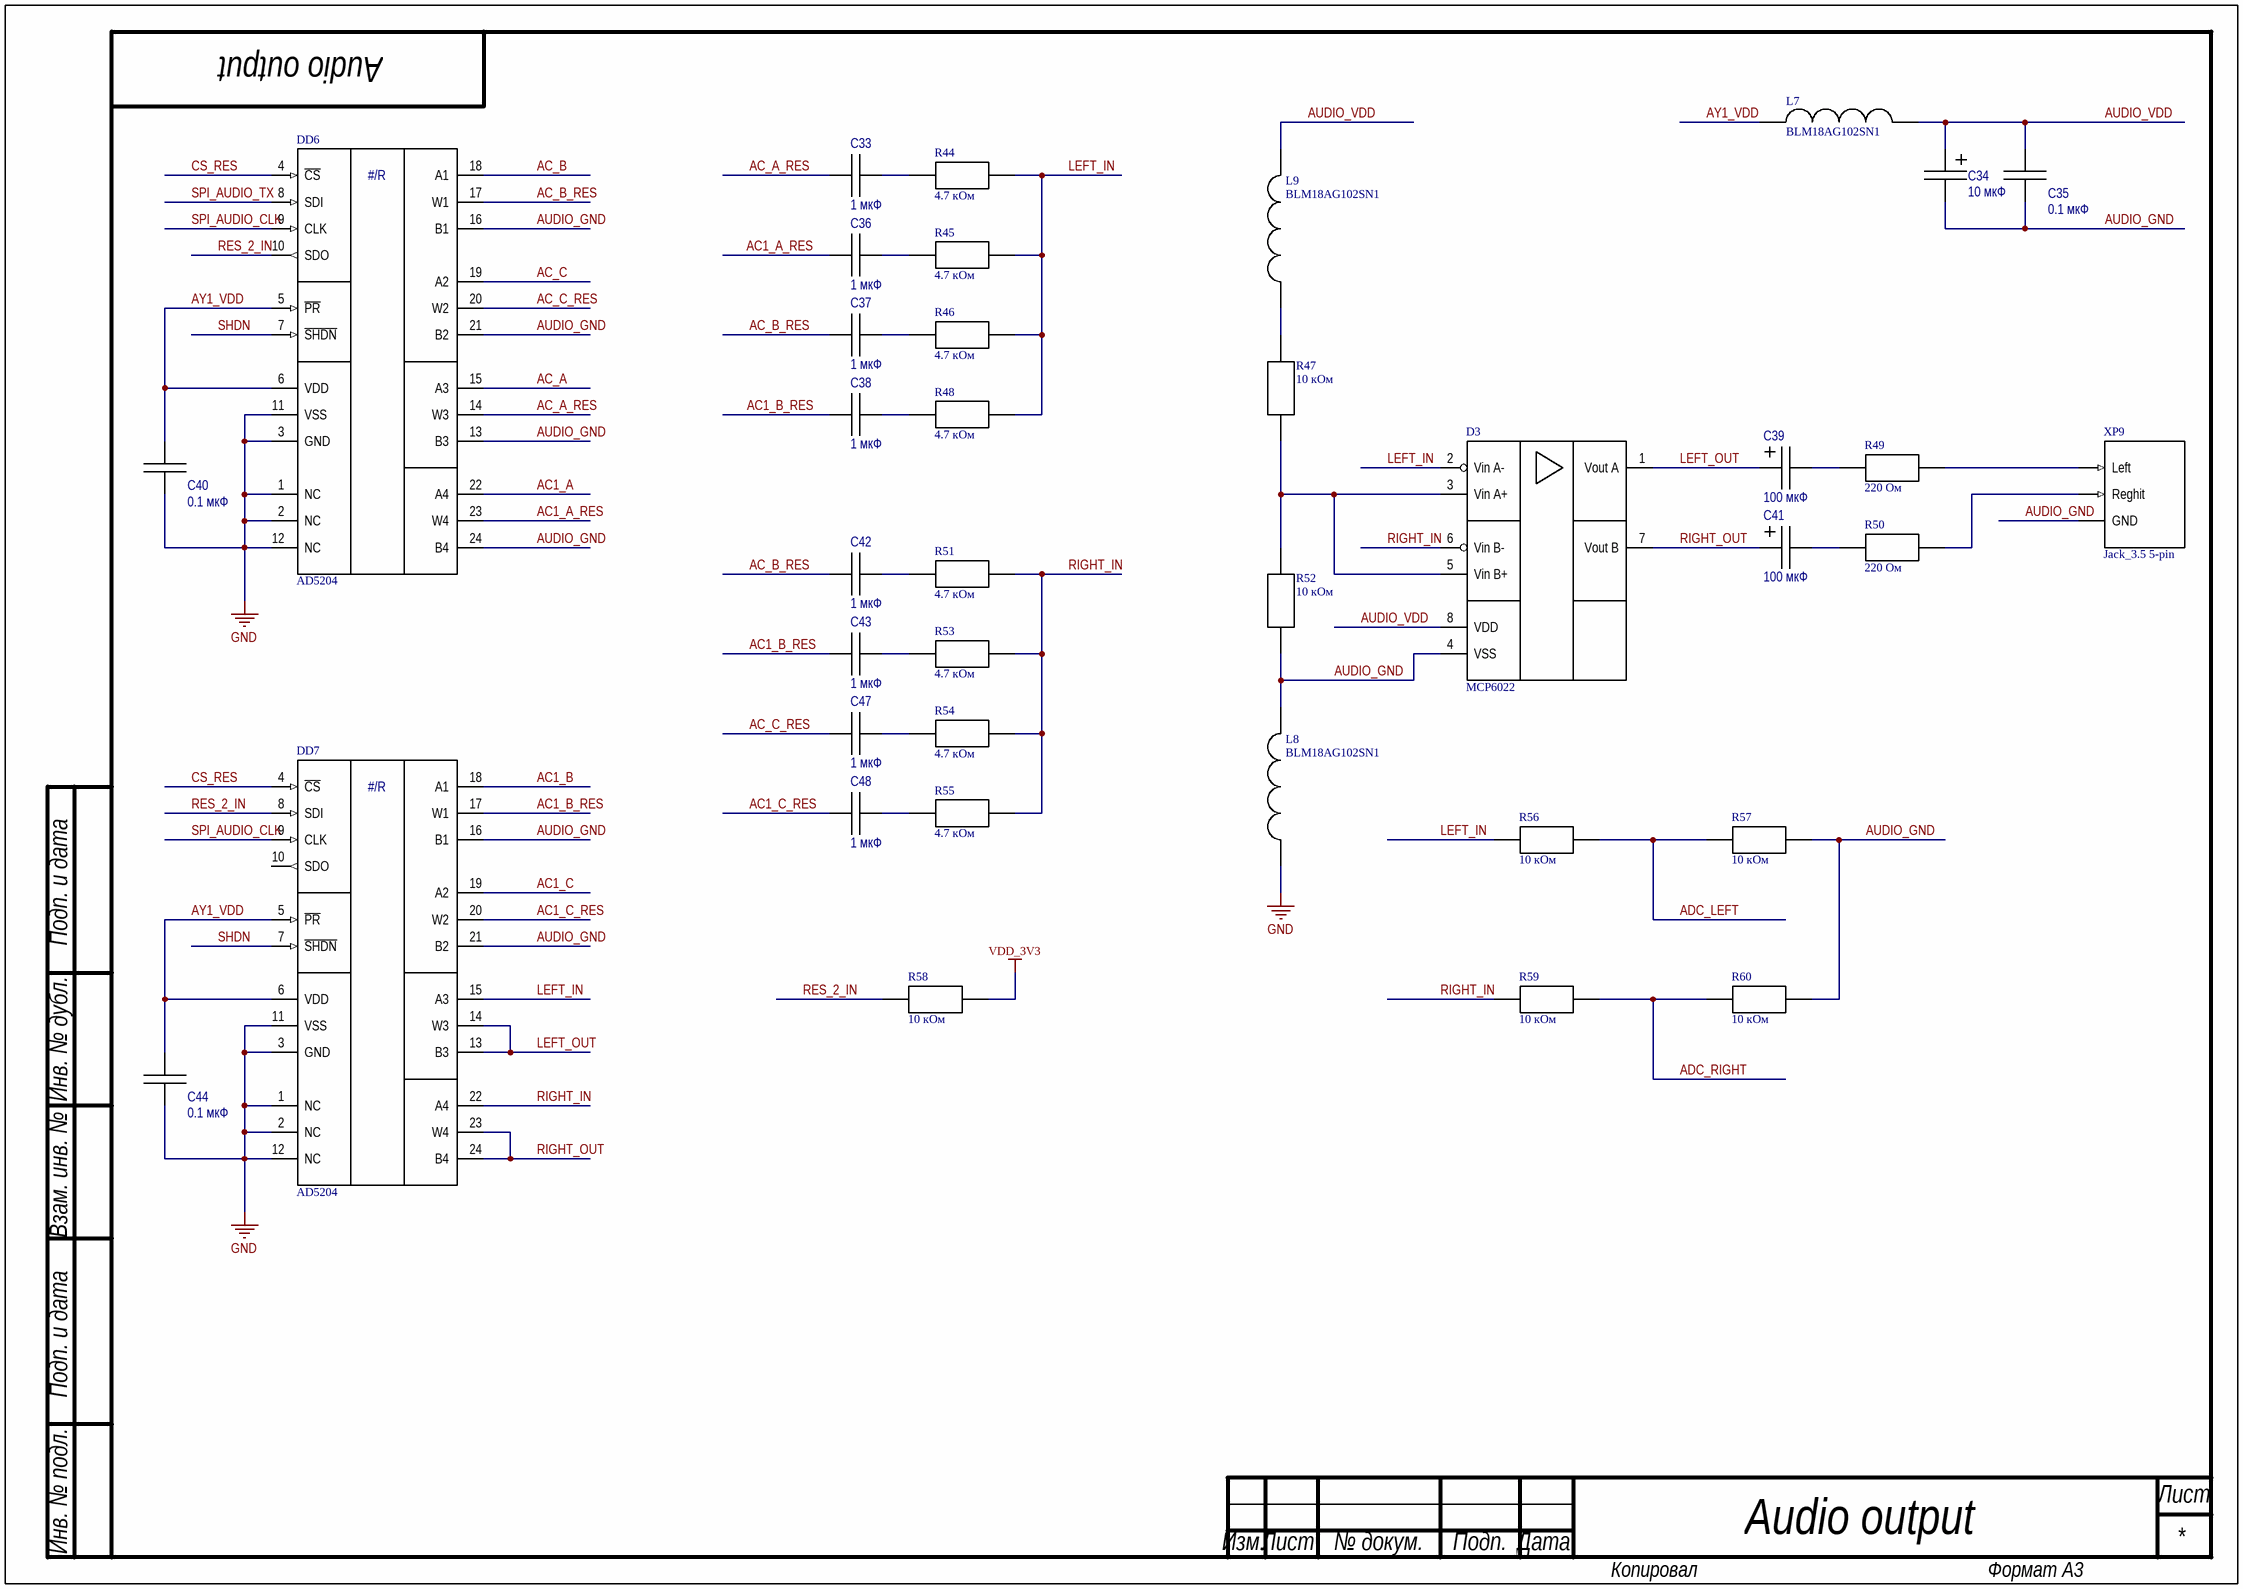
[diagram p4: audio_out.SchDoc]

### Parts
C33  1 мкФ  [C 1206]
C34  10 мкФ  [C TAN_C]
C35  0.1 мкФ  [C 1206]
C36  1 мкФ  [C 1206]
C37  1 мкФ  [C 1206]
C38  1 мкФ  [C 1206]
C39  100 мкФ  [C TAN_D]
C40  0.1 мкФ  [C 1206]
C41  100 мкФ  [C TAN_D]
C42  1 мкФ  [C 1206]
C43  1 мкФ  [C 1206]
C44  0.1 мкФ  [C 1206]
C47  1 мкФ  [C 1206]
C48  1 мкФ  [C 1206]
D3  MCP6022  [SOIC-8]
DD6  AD5204  [TSSOP-24]
DD7  AD5204  [TSSOP-24]
L7  BLM18AG102SN1  [FB 0603]
L8  BLM18AG102SN1  [FB 0603]
L9  BLM18AG102SN1  [FB 0603]
R44  4.7 кОм  [RES 0805]
R45  4.7 кОм  [RES 0805]
R46  4.7 кОм  [RES 0805]
R47  10 кОм  [RES 0805]
R48  4.7 кОм  [RES 0805]
R49  220 Ом  [RES 0805]
R50  220 Ом  [RES 0805]
R51  4.7 кОм  [RES 0805]
R52  10 кОм  [RES 0805]
R53  4.7 кОм  [RES 0805]
R54  4.7 кОм  [RES 0805]
R55  4.7 кОм  [RES 0805]
R56  10 кОм  [RES 0805]
R57  10 кОм  [RES 0805]
R58  10 кОм  [RES 0805]
R59  10 кОм  [RES 0805]
R60  10 кОм  [RES 0805]
XP9  Jack_3.5 5-pin  [JACK 3.5  female]

### Nets
GND: C40.2 C44.2 DD6.1(NC) DD6.2(NC) DD6.3(GND) DD6.11(VSS) DD6.12(NC) DD7.1(NC) DD7.2(NC) DD7.3(GND) DD7.11(VSS) DD7.12(NC) L8.1
VDD_3V3: R58.2
AC1_A: DD6.22(A4)
AC1_A_RES: C36.1 DD6.23(W4)
AC1_B: DD7.18(A1)
AC1_B_RES: C38.1 C43.1 DD7.17(W1)
AC1_C: DD7.19(A2)
AC1_C_RES: C48.1 DD7.20(W2)
AC_A: DD6.15(A3)
AC_A_RES: C33.1 DD6.14(W3)
AC_B: DD6.18(A1)
AC_B_RES: C37.1 C42.1 DD6.17(W1)
AC_C: DD6.19(A2)
AC_C_RES: C47.1 DD6.20(W2)
ADC_LEFT: R56.1 R57.2
ADC_RIGHT: R59.1 R60.2
AUDIO_GND: C34.2 C35.2 D3.4(VSS) DD6.13(B3) DD6.16(B1) DD6.21(B2) DD6.24(B4) DD7.16(B1) DD7.21(B2) L8.2 R52.1 R57.1 R60.1 XP9.G(GND)
AUDIO_VDD: C34.1 C35.1 D3.8(VDD) L7.2 L9.2
AY1_VDD: C40.1 C44.1 DD6.5(~{PR}) DD6.6(VDD) DD7.5(~{PR}) DD7.6(VDD) L7.1
CS_RES: DD6.4(~{CS}) DD7.4(~{CS})
LEFT_IN: D3.2(Vin_A-) DD7.15(A3) R44.2 R45.2 R46.2 R48.2 R56.2
LEFT_OUT: C39.1 D3.1(Vout_A) DD7.13(B3) DD7.14(W3)
RES_2_IN: DD6.10(SDO) DD7.8(SDI) R58.1
RIGHT_IN: D3.6(Vin_B-) DD7.22(A4) R51.2 R53.2 R54.2 R55.2 R59.2
RIGHT_OUT: C41.1 D3.7(Vout_B) DD7.23(W4) DD7.24(B4)
SHDN: DD6.7(~{SHDN}) DD7.7(~{SHDN})
SPI_AUDIO_CLK: DD6.9(CLK) DD7.9(CLK)
SPI_AUDIO_TX: DD6.8(SDI)
NetC33_2: C33.2 R44.1
NetC36_2: C36.2 R45.1
NetC37_2: C37.2 R46.1
NetC38_2: C38.2 R48.1
NetC39_2: C39.2 R49.1
NetC41_2: C41.2 R50.1
NetC42_2: C42.2 R51.1
NetC43_2: C43.2 R53.1
NetC47_2: C47.2 R54.1
NetC48_2: C48.2 R55.1
NetD3_3: D3.3(Vin_A+) D3.5(Vin_B+) R47.1 R52.2
NetL9_1: L9.1 R47.2
NetR49_2: R49.2 XP9.L(Left)
NetR50_2: R50.2 XP9.R(Reghit)

Not connected (* = marked no-connect by the designer): DD7 10(SDO)

### Notes on the sheet
- Подп. и дата
- Инв. № дубл.
- Взам. инв. №
- Инв. № подл.
- Лист
- Изм.
- № докум.
- Подп.
- Дата
- Копировал
- Формат А3
- (in symbol AD5204) #/R

### Library data of the parts
C33 C35-C38 C40 C42-C44 C47 C48 = CAP 1206: as C15 on sheet mk; Size: 1206; Temperature range: /Формат: -? ... ? °C/
  C35 C40 C44: Value: 0.1 мкФ
C34 = CAP TAN_C: as C14 on sheet mk; Size: C; Temperature range: /Формат: -? ... ? °C/; Value: 10 мкФ
C39 C41 = CAP TAN_D: as C3 on sheet power_sheet; Size: D; Temperature range: /Формат: -? ... ? °C/; Value: 100 мкФ
R44-R60 = RES 0805

## Nets that join several sheets
GND: mk (5 pins), power_sheet (24 pins), conect_sheet (28 pins), audio_sheet (17 pins), audio_out (13 pins)
USB_VDD: mk (DD1.42), power_sheet (C46.1 DA1.4 DA1.8), conect_sheet (XS1.1)
VDD_3V3: mk (L4.1), power_sheet (C8.1 C9.1 DA2.5), conect_sheet (5 pins), audio_sheet (6 pins), audio_out (R58.2)
5V_ON: mk (DD1.8), power_sheet (R16.2)
AC1_A: audio_sheet (DD3.4), audio_out (DD6.22)
AC1_B: audio_sheet (DD3.3), audio_out (DD7.18)
AC1_C: audio_sheet (DD3.38), audio_out (DD7.19)
AC_A: audio_sheet (DD2.5), audio_out (DD6.15)
AC_B: audio_sheet (DD2.4), audio_out (DD6.18)
AC_C: audio_sheet (DD2.1), audio_out (DD6.19)
ADC_BAT: mk (DD1.14), conect_sheet (C1.1 R26.1 R29.2)
ADC_LEFT: mk (DD1.27), audio_out (R56.1 R57.2)
ADC_RIGHT: mk (DD1.20), audio_out (R59.1 R60.2)
AY1_ON: mk (DD1.56), power_sheet (R17.2)
AY1_VDD: power_sheet (VT5.3), audio_sheet (5 pins), audio_out (7 pins)
AY2_ON: mk (DD1.33), power_sheet (R18.2)
AY2_VDD: power_sheet (VT6.3), audio_sheet (5 pins)
AY_1_RES: mk (DD1.50), audio_sheet (R38.1)
AY_2_RES: mk (DD1.36), audio_sheet (R42.1)
AY_CLK: mk (DD1.26), audio_sheet (DD2.15 DD3.22)
B_V_DOWN: mk (DD1.16), conect_sheet (C20.1 XP5.2)
B_V_UP: mk (DD1.15), conect_sheet (C21.1 XP5.1)
BC1: mk (DD1.37), audio_sheet (DD2.20 DD3.29)
BDIR: mk (DD1.43), audio_sheet (DD2.18 DD3.27)
BOOT_0: mk (DD1.60), conect_sheet (R30.2 XP4.2)
BOOT_RX: mk (DD1.30), conect_sheet (XP3.2)
BOOT_TX: mk (DD1.29), conect_sheet (XP3.1)
BUTTON_IN: mk (DD1.38), conect_sheet (C45.1 XP7.8)
CS_RES: mk (DD1.35), audio_out (DD6.4 DD7.4)
DA0: conect_sheet (XP7.1), audio_sheet (DD2.28 DD4.15)
DA1: conect_sheet (XP7.2), audio_sheet (DD2.27 DD4.1)
DA2: conect_sheet (XP7.3), audio_sheet (DD2.26 DD4.2)
DA3: conect_sheet (XP7.4), audio_sheet (DD2.25 DD4.3)
DA4: conect_sheet (XP7.5), audio_sheet (DD2.24 DD4.4)
DA5: conect_sheet (XP7.6), audio_sheet (DD2.23 DD4.5)
DA6: conect_sheet (XP7.7), audio_sheet (DD2.22 DD4.6)
LCD_CLK: mk (DD1.21), conect_sheet (XP10.3)
LCD_CS: mk (DD1.28), conect_sheet (XP10.8)
LCD_DC: mk (DD1.25), conect_sheet (XP10.4)
LCD_MISO: mk (DD1.22), conect_sheet (R61.1 R62.2)
LCD_MOSI: mk (DD1.23), conect_sheet (XP10.5)
LCD_RES: mk (DD1.24), conect_sheet (XP10.2)
MIDI_UART_RX: mk (DD1.17), conect_sheet (R31.1 U1.4)
MK_VDD: mk (14 pins), conect_sheet (XP4.1)
POWER_ON: mk (DD1.9), power_sheet (R9.2)
SD1_PUSH: mk (DD1.41), conect_sheet (XS2.10)
SD2_CLK: mk (DD1.34), conect_sheet (XS3.5)
SD2_CS: mk (DD1.59), conect_sheet (R4.2 XS3.2)
SD2_PUSH: mk (DD1.62), conect_sheet (XS3.10)
SD2_RX: mk (DD1.10), conect_sheet (XS3.7)
SD2_TX: mk (DD1.11), conect_sheet (XS3.3)
SD_CLK: mk (DD1.53), conect_sheet (XS2.5)
SD_D0: mk (DD1.39), conect_sheet (R25.2 XS2.7)
SD_D1: mk (DD1.40), conect_sheet (R27.2 XS2.8)
SD_D2: mk (DD1.51), conect_sheet (R3.2 XS2.1)
SD_D3: mk (DD1.52), conect_sheet (R28.2 XS2.2)
SD_SMD: mk (DD1.54), conect_sheet (R24.2 XS2.3)
SHDN: mk (DD1.58), audio_out (DD6.7 DD7.7)
SPI_AUDIO_CLK: mk (DD1.55), audio_sheet (DD4.11 DD5.11), audio_out (DD6.9 DD7.9)
SPI_AUDIO_ST_REG: mk (DD1.61), audio_sheet (DD4.12 DD5.12)
SPI_AUDIO_TX: mk (DD1.57), audio_sheet (DD4.14), audio_out (DD6.8)
SWDCLK: mk (DD1.49), conect_sheet (XP6.2)
SWDIO: mk (DD1.46), conect_sheet (XP6.1)
TP_BAT: power_sheet (DA1.5 VT1.3), conect_sheet (R26.2 XP1.1)
TP_CH: mk (DD1.4), power_sheet (DA1.7)
TP_ST: mk (DD1.3), power_sheet (DA1.6)
USB_DM: mk (DD1.44), conect_sheet (R2.1)
USB_DP: mk (DD1.45), conect_sheet (R1.1)